# EasyEDA Pro project 遥控器PCB设计.eprj, schematic 遥控器_v2_1
Board Name: 遥控器_V2_3通道简化版_V1.1; Create Date: 2025-06-02; Page Name: P1; Project Name: 遥控器PCB设计; Schematic Name: 遥控器_v2_1; Update Date: 2025-06-02; Company: 嘉立创EDA; Page Size: A4; Version: V1.0
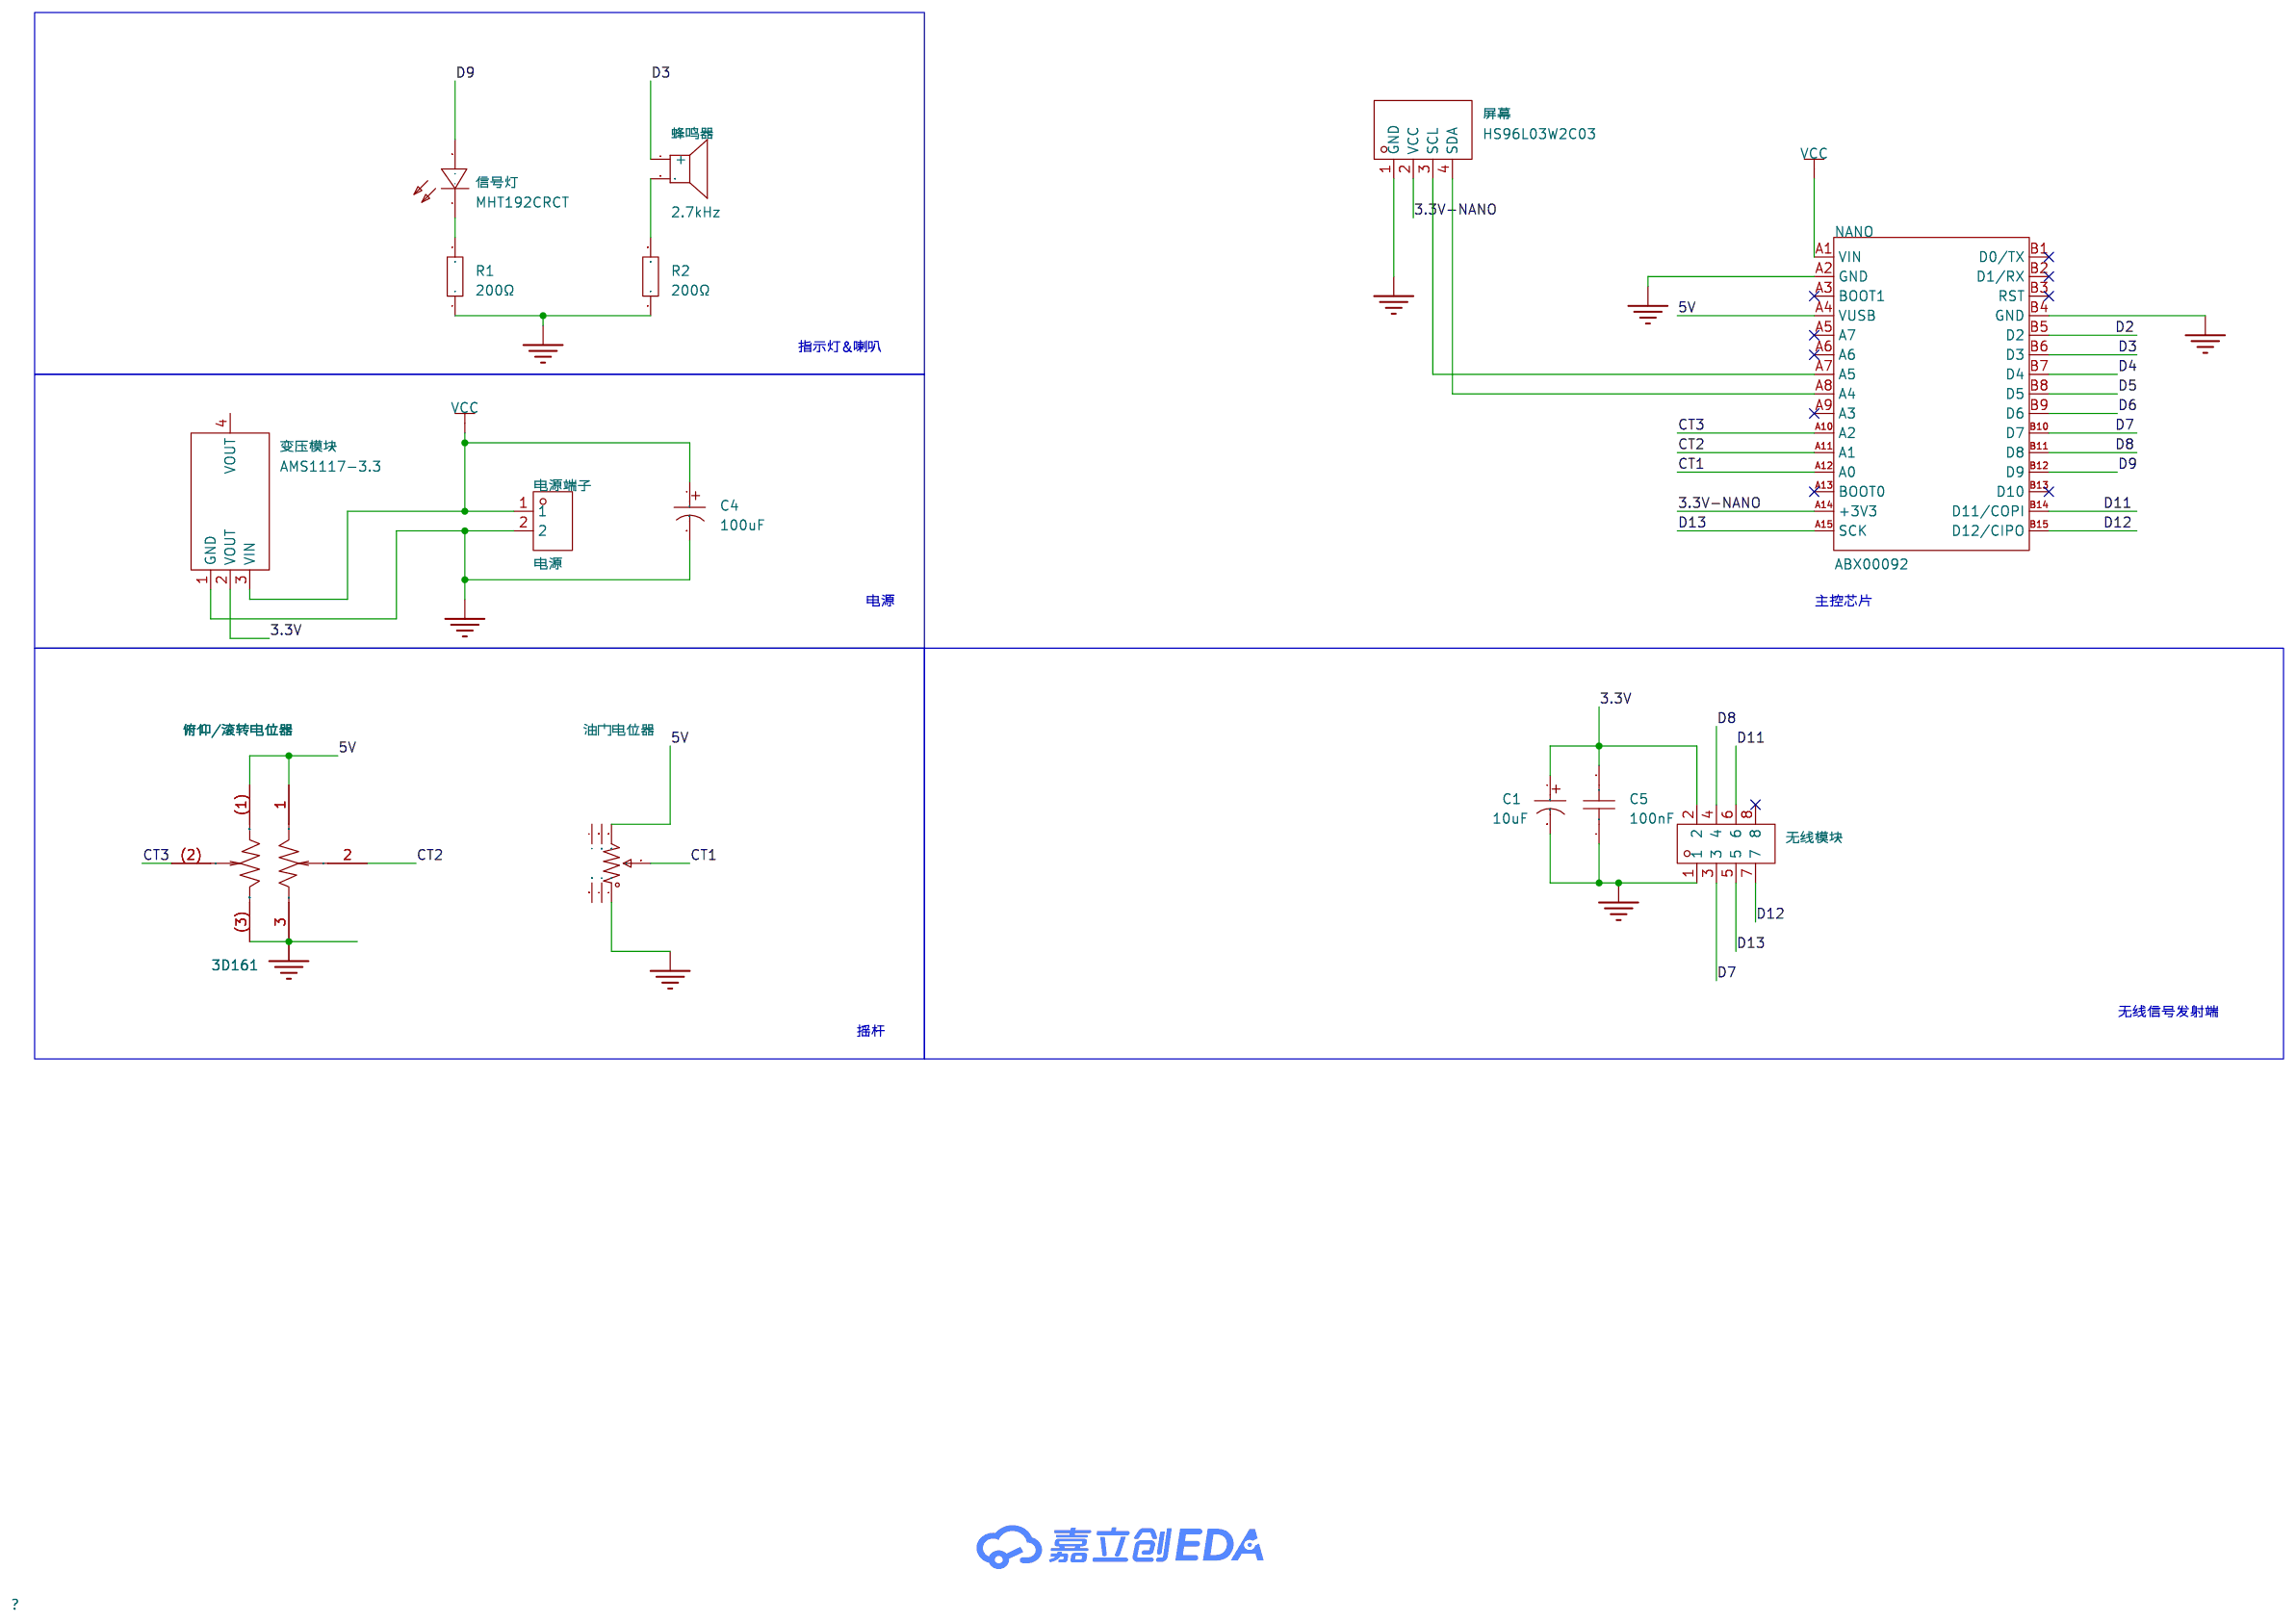
[diagram p5: schematic sheet]

## Parts
C1  10uF  [CAP-TH_BD10.0-P5.00-D1.0-FD]
C4  100uF  [CAP-TH_BD10.0-P5.00-D1.0-FD]
C5  100nF  [C0603]
NANO  ABX00092  [COMM-TH_ABX00092]
R1  200Ω  [R0603]
R2  200Ω  [R0603]
信号灯  MHT192CRCT  [LED0603-RD]
俯仰/滚转电位器  3D161  [SW-TH_3D161]
变压模块  AMS1117-3.3  [SOT-223-3_L6.5-W3.4-P2.30-LS7.0-BR]
屏幕  HS96L03W2C03  [OLED-TH_L27.8-W27.2-P2.54_C9900033791]
无线模块  PM254V-12-08-H85  [HDR-TH_8P-P2.54-V-F-R2-C4-S2.54]
油门电位器  Y16-YZL7.2-B5Kb(55)-G-C01  [RES-ADJ-TH_Y16-YZL7.2-B5KB55-G-C01]
电源端子  电源  [CONN-TH_P5.00_KF301-5.0-2P]
蜂鸣器  2.7kHz  [BUZ-TH_BD12.0-P7.60-D0.6-FD]

## Library data of the parts
C1 C4 = ERS1HM471G20OT: 容值:470uF;精度:±20%;额定电压:50V;; LCSC Part Name: 470uF ±20% 50V; Supplier Part: C106666; Manufacturer: AISHI(艾华集团); Supplier Footprint: 插件,D10xL20mm; JLCPCB Part Class: 扩展库; Datasheet: https://atta.szlcsc.com/upload/public/pdf/source/20191015/C438940_4B8E60A742BB0AE40DDEF87A5C89089D.pdf; Supplier: LCSC; Tolerance: ±20%; Rated Voltage: 50V; Lead Spacing: 5mm; φD: 10mm; L: 20mm; Lifetime @ Temp: 7000hrs@105℃
C5 = CGA0603X7R104K500JT: 容值:100nF;精度:±10%;额定电压:50V;材质(温度系数):X7R;; LCSC Part Name: 100nF ±10% 50V; Supplier Part: C6119867; Manufacturer: HRE(芯声); Supplier Footprint: 0603; JLCPCB Part Class: 扩展库; Supplier: LCSC; Tolerance: ±10%; Voltage Rated: 50V; Temperature Coefficient: X7R
NANO = ABX00092: Supplier Part: C22392566; Manufacturer: arduino; JLCPCB Part Class: 扩展库; Datasheet: https://atta.szlcsc.com/upload/public/pdf/source/20240508/B4DB31292A327EFF3440EB84C8D7CAB2.pdf; Supplier: LCSC
R1 R2 = 0603WAF1000T5E: 电阻类型:厚膜电阻;阻值:100Ω;精度:±1%;功率:100mW;最大工作电压:75V;温度系数:±200ppm/℃;; LCSC Part Name: 100Ω ±1% 100mW 厚膜电阻; Supplier Part: C22775; Manufacturer: UNI-ROYAL(厚声); Supplier Footprint: 0603; JLCPCB Part Class: 基础库; Datasheet: https://atta.szlcsc.com/upload/public/pdf/source/20200306/C422600_1E6D84923E4A46A82E41ADD87F860B5C.pdf; Supplier: LCSC; Type: 厚膜电阻; Tolerance: ±1%; Power(Watts): 100mW; Overload Voltage (Max): 75V; Temperature Coefficient: ±200ppm/℃; Operating Temperature Range: -55℃~+155℃
信号灯 = MHT192CRCT: 发光颜色:红色;功率:60mW;正向电流:5mA;主波长:621.5nm~633.5nm;二极管配置:-;透镜颜色:无色透明透镜;色温:-;发光角度:120°;载带方式:-;工作温度:-40℃~+85℃;; LCSC Part Name: 红灯; Supplier Part: C389517; Manufacturer: MEIHUA(美华); Supplier Footprint: 0603; JLCPCB Part Class: 扩展库; Datasheet: https://atta.szlcsc.com/upload/public/pdf/source/20190515/C389517_475281E0F1091F4CD4C8D85EF0064C5B.pdf; Supplier: LCSC; Emitted Color: 红色; Power Dissipation: 60mW; Forward Current: 5mA; Dominant Wavelength: 621.5nm~633.5nm; Peak Wavelength: 639nm; Lens Color: 无色透明透镜; Viewing Angle: 120°; Operating Temperature: -40℃~+85℃
俯仰/滚转电位器 = 3D161: 摇杆  多向; LCSC Part Name: 3D161  3D摇杆 自恢复; Supplier Part: C92593; Manufacturer: 韩国韩荣; Supplier Footprint: 插件,16x16mm; JLCPCB Part Class: 扩展库; Datasheet: https://atta.szlcsc.com/upload/public/pdf/source/20170523/1495534045704.pdf; Supplier: LCSC
变压模块 = AMS1117-3.3_C6186: 输出类型:固定;工作电压:-;输出电压:3.3V;输出电流:1A;电源纹波抑制比(PSRR):72dB@(120Hz);输出极性:正极;; LCSC Part Name: 输出3.3V 1A; Supplier Part: C6186; Manufacturer: AMS; Supplier Footprint: SOT-223; JLCPCB Part Class: Basic Part; Datasheet: https://atta.szlcsc.com/upload/public/pdf/source/20180727/C6186_7A095716F0823C02F1997A905E26C086.pdf; Supplier: LCSC; Output Type: 固定; Output Voltage: 3.3V; Output Current: 1A; Power Supply Rejection Ratio (PSRR): 72dB@(120Hz); Voltage Dropout: 1.3V@(800mA); Features: 过流保护(OCP)；热关断(TSD); Output Configuration: 正极; Number of Outputs: 1
屏幕 = HS96L03W2C03: 主控芯片:SSD1315;接口类型:I2C;尺寸(inch):0.96;像素分辨率:128x64;; LCSC Part Name: 0.96寸OLED显示屏窄白光IIC; Supplier Part: C5248080; Manufacturer: HS(汉昇); JLCPCB Part Class: 扩展库; Datasheet: https://atta.szlcsc.com/upload/public/pdf/source/20230627/763D01F79A90007632F098068C7C8AD9.pdf; Supplier: LCSC; Main Control Chip: SSD1315; Interface Type: I2C; Size: 0.96; Pixel Resolution: 128x64; Operating Temperature: -40℃~+70℃
无线模块 = PM254V-12-08-H85: 插孔结构:2x4P;间距:2.54mm;行距:2.54mm;圆孔/方孔:方孔;安装类型:直插;排数:双排;总孔位数:8P;额定电流:3A;额定电压:250V;插孔方向:顶部;塑高:8.5mm;工作温度范围:-40℃~+105℃;; LCSC Part Name: 间距:2.54mm 2x4P 直插; Supplier Part: C2834799; Manufacturer: XFCN(兴飞); Supplier Footprint: 插件,P=2.54mm; JLCPCB Part Class: 扩展库; Datasheet: https://atta.szlcsc.com/upload/public/pdf/source/20200309/C492399_8C441E2934FBB604A89B37A68AA45ECF.pdf; Supplier: LCSC; Holes Structure: 2x4P; Pitch: 2.54mm; Row Spacing: 2.54mm; Circular Hole / Square Hole: 方孔; Mounting Type: 直插; Number of Rows: 双排; Number of Holes: 8P; Current Rating (Max): 3A; Voltage Rating (Max): 250V; Holes Direction: 顶部; Insulation Height: 8.5mm; Operating Temperature Range: -40℃~+105℃
油门电位器 = Y16-YZL7.2-B5Kb(55)-G-C01: 摇杆电位器、操纵杆电位器，适用于航模玩具遥控器电位器、3D摇杆PS4手柄游戏机、无人机摇杆电位器、VR摇杆电位器、工业控制器; Supplier Part: C37323743; Manufacturer: YTL(亚特联); Supplier Footprint: 插件-7P,19.8x15.5mm; JLCPCB Part Class: 扩展库; Datasheet: https://atta.szlcsc.com/upload/public/pdf/source/20240806/CE5C57122514D828D960FC3B4F94AB1F.pdf; Supplier: LCSC
电源端子 = KF301-5.0-2P: 结构:1x2P;间距:5mm;颜色:蓝色;安装方式:直插;额定电流:17A;额定电压:250V;排数:1;线规 - AWG:14~22;线规 - 平方毫米:1.5;每排PIN数:2;工作温度范围:-30℃~+120℃;; LCSC Part Name: 5mm 1x2P 排数:1 每排P数:2 直插; Supplier Part: C474881; Manufacturer: KEFA(科发); Supplier Footprint: 插件,P=5mm; JLCPCB Part Class: 扩展库; Datasheet: https://atta.szlcsc.com/upload/public/pdf/source/20230317/03A5B5FC229D6F9225E8F51DA1A4E80A.pdf; Supplier: LCSC; Structure: 1x2P; Pitch: 5mm; Color: 蓝色; Mounting Style: 直插; Current Rating (Max): 17A; Voltage Rating (Max): 250V; Number of Pins: 2P; Number of Rows: 1; Wire Gauge - AWG: 14~22; Wire Gauge - mm2: 1.5; Number of PINs Per Row: 2; Operating Temperature Range: -30℃~+120℃
蜂鸣器 = SUN-12095-5VPA7.6: 驱动方式:有源(内含驱动线路);构造类型:电磁式;额定电压:-;频率:2.7kHz;声压(SPL):85dB;; LCSC Part Name: 电磁有源蜂鸣器; Supplier Part: C360615; Manufacturer: S&S(海旭); Supplier Footprint: 插件,D=12mm; JLCPCB Part Class: Extended Part; Datasheet: https://atta.szlcsc.com/upload/public/pdf/source/20210819/7581CEB8074681E6630BEBBFB8B64446.pdf; Supplier: LCSC; Driver Circuitry: 有源(内含驱动线路); Technology: 电磁式; Voltage - Supply: 4V~7V; Sound Pressure Level(SPL): 85dB; Diameter(φD): 12mm; Height: 9.8mm

## Nets
3.3V: C1.1 C5.2 变压模块.2(VOUT) 无线模块.2
3.3V-NANO: NANO.A14(+3V3) 屏幕.2(VCC)
5V: NANO.A4(VUSB) 俯仰/滚转电位器.1 俯仰/滚转电位器.(1) 油门电位器.3
GND: C1.2 C4.2 C5.1 NANO.A2(GND) NANO.B4(GND) R1.1 R2.1 俯仰/滚转电位器.3 俯仰/滚转电位器.(3) 变压模块.1(GND) 屏幕.1(GND) 无线模块.1 油门电位器.1 电源端子.2
VCC: C4.1 NANO.A1(VIN) 变压模块.3(VIN) 电源端子.1
CT1: NANO.A12(A0) 油门电位器.2
CT2: NANO.A11(A1) 俯仰/滚转电位器.2
CT3: NANO.A10(A2) 俯仰/滚转电位器.(2)
D2: NANO.B5(D2)
D3: NANO.B6(D3) 蜂鸣器.1(+)
D4: NANO.B7(D4)
D5: NANO.B8(D5)
D6: NANO.B9(D6)
D7: NANO.B10(D7) 无线模块.3
D8: NANO.B11(D8) 无线模块.4
D9: NANO.B12(D9) 信号灯.2(+)
D11: NANO.B14(D11/COPI) 无线模块.6
D12: NANO.B15(D12/CIPO) 无线模块.7
D13: NANO.A15(SCK) 无线模块.5
$1N4023: R1.2 信号灯.1(-)
$1N4810: NANO.A8(A4) 屏幕.4(SDA)
$1N4819: NANO.A7(A5) 屏幕.3(SCL)
$1N7039: R2.2 蜂鸣器.2

Not connected (* = marked no-connect by the designer): NANO A3(BOOT1)* A5(A7)* A6* A9(A3)* A13(BOOT0)* B1(D0/TX)* B2(D1/RX)* B3(RST)* B13(D10)*; 变压模块 4(VOUT); 无线模块 8*; 油门电位器 4 5 6 7

## Notes on the sheet
- 指示灯&喇叭
- 电源
- 主控芯片
- 摇杆
- 无线信号发射端
